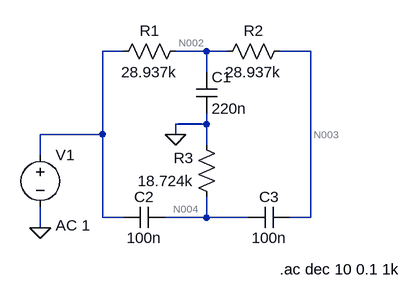
[diagram p0: schematic Notch_50hz.asc]
Notch_50hz.asc, the LTspice schematic file:
Version 4
SHEET 1 880 680
WIRE 112 80 80 80
WIRE 240 80 192 80
WIRE 272 80 240 80
WIRE 400 80 352 80
WIRE 240 112 240 80
WIRE 240 192 240 176
WIRE 240 192 192 192
WIRE 80 208 80 80
WIRE 80 208 -16 208
WIRE 192 208 192 192
WIRE 240 224 240 192
WIRE -16 240 -16 208
WIRE 80 336 80 208
WIRE 112 336 80 336
WIRE 240 336 240 304
WIRE 240 336 176 336
WIRE 304 336 240 336
WIRE 400 336 400 80
WIRE 400 336 368 336
WIRE -16 352 -16 320
FLAG 192 208 0
FLAG -16 352 0
SYMBOL res 208 64 R90
WINDOW 0 0 56 VBottom 2
WINDOW 3 32 56 VTop 2
SYMATTR InstName R1
SYMATTR Value 28.937k
SYMBOL res 368 64 R90
WINDOW 0 0 56 VBottom 2
WINDOW 3 32 56 VTop 2
SYMATTR InstName R2
SYMATTR Value 28.937k
SYMBOL res 256 320 R180
WINDOW 0 36 76 Left 2
WINDOW 3 36 40 Left 2
SYMATTR InstName R3
SYMATTR Value 18.724k
SYMBOL cap 224 112 R0
SYMATTR InstName C1
SYMATTR Value 220n
SYMBOL cap 176 320 R90
WINDOW 0 0 32 VBottom 2
WINDOW 3 32 32 VTop 2
SYMATTR InstName C2
SYMATTR Value 100n
SYMBOL cap 368 320 R90
WINDOW 0 0 32 VBottom 2
WINDOW 3 32 32 VTop 2
SYMATTR InstName C3
SYMATTR Value 100n
SYMBOL voltage -16 224 R0
WINDOW 123 24 124 Left 2
WINDOW 39 0 0 Left 0
SYMATTR Value2 AC 1
SYMATTR InstName V1
SYMATTR Value ""
TEXT 352 416 Left 2 !.ac dec 10 0.1 1k

The netlist it stands for:
* Notch_50hz.asc
R1 N002 N001 28.937k
R2 N003 N002 28.937k
R3 N004 0 18.724k
C1 N002 0 220n
C2 N004 N001 100n
C3 N003 N004 100n
V1 N001 0 AC 1
.ac dec 10 0.1 1k
.backanno
.end

* Results of the author's LTspice run, read from the files saved beside the schematic
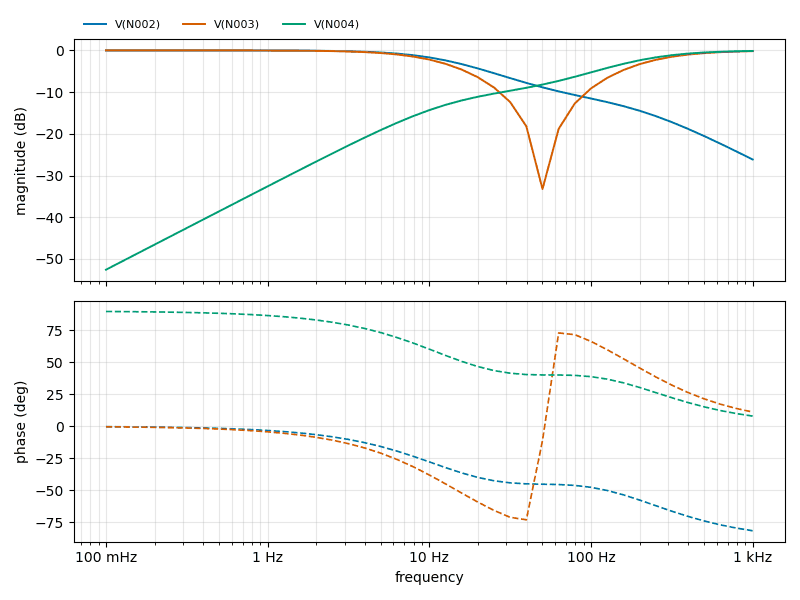
[diagram p1: AC Analysis of Notch_50hz.asc, plotted from the saved traces]
* AC Analysis, 1 run:
*   V(N002): -0.00 dB at 100 mHz, -26.16 dB at 1 kHz, peak -0.00 dB at 100 mHz, 3 dB below the peak at 14.79 Hz
*   V(N003): -0.00 dB at 100 mHz, -0.17 dB at 1 kHz, peak -0.00 dB at 100 mHz, 3 dB below the peak at 12.02 Hz
*   V(N004): -52.57 dB at 100 mHz, -0.13 dB at 1 kHz, peak -0.13 dB at 1 kHz, 3 dB below the peak at 161.8 Hz